# EAGLE design ums (EAGLE 7.6.0)
R.NET interface dongle v.1 OH7JEV & OH3HZB 2013 Based on OH2LAK's CM108 soundcard mod.
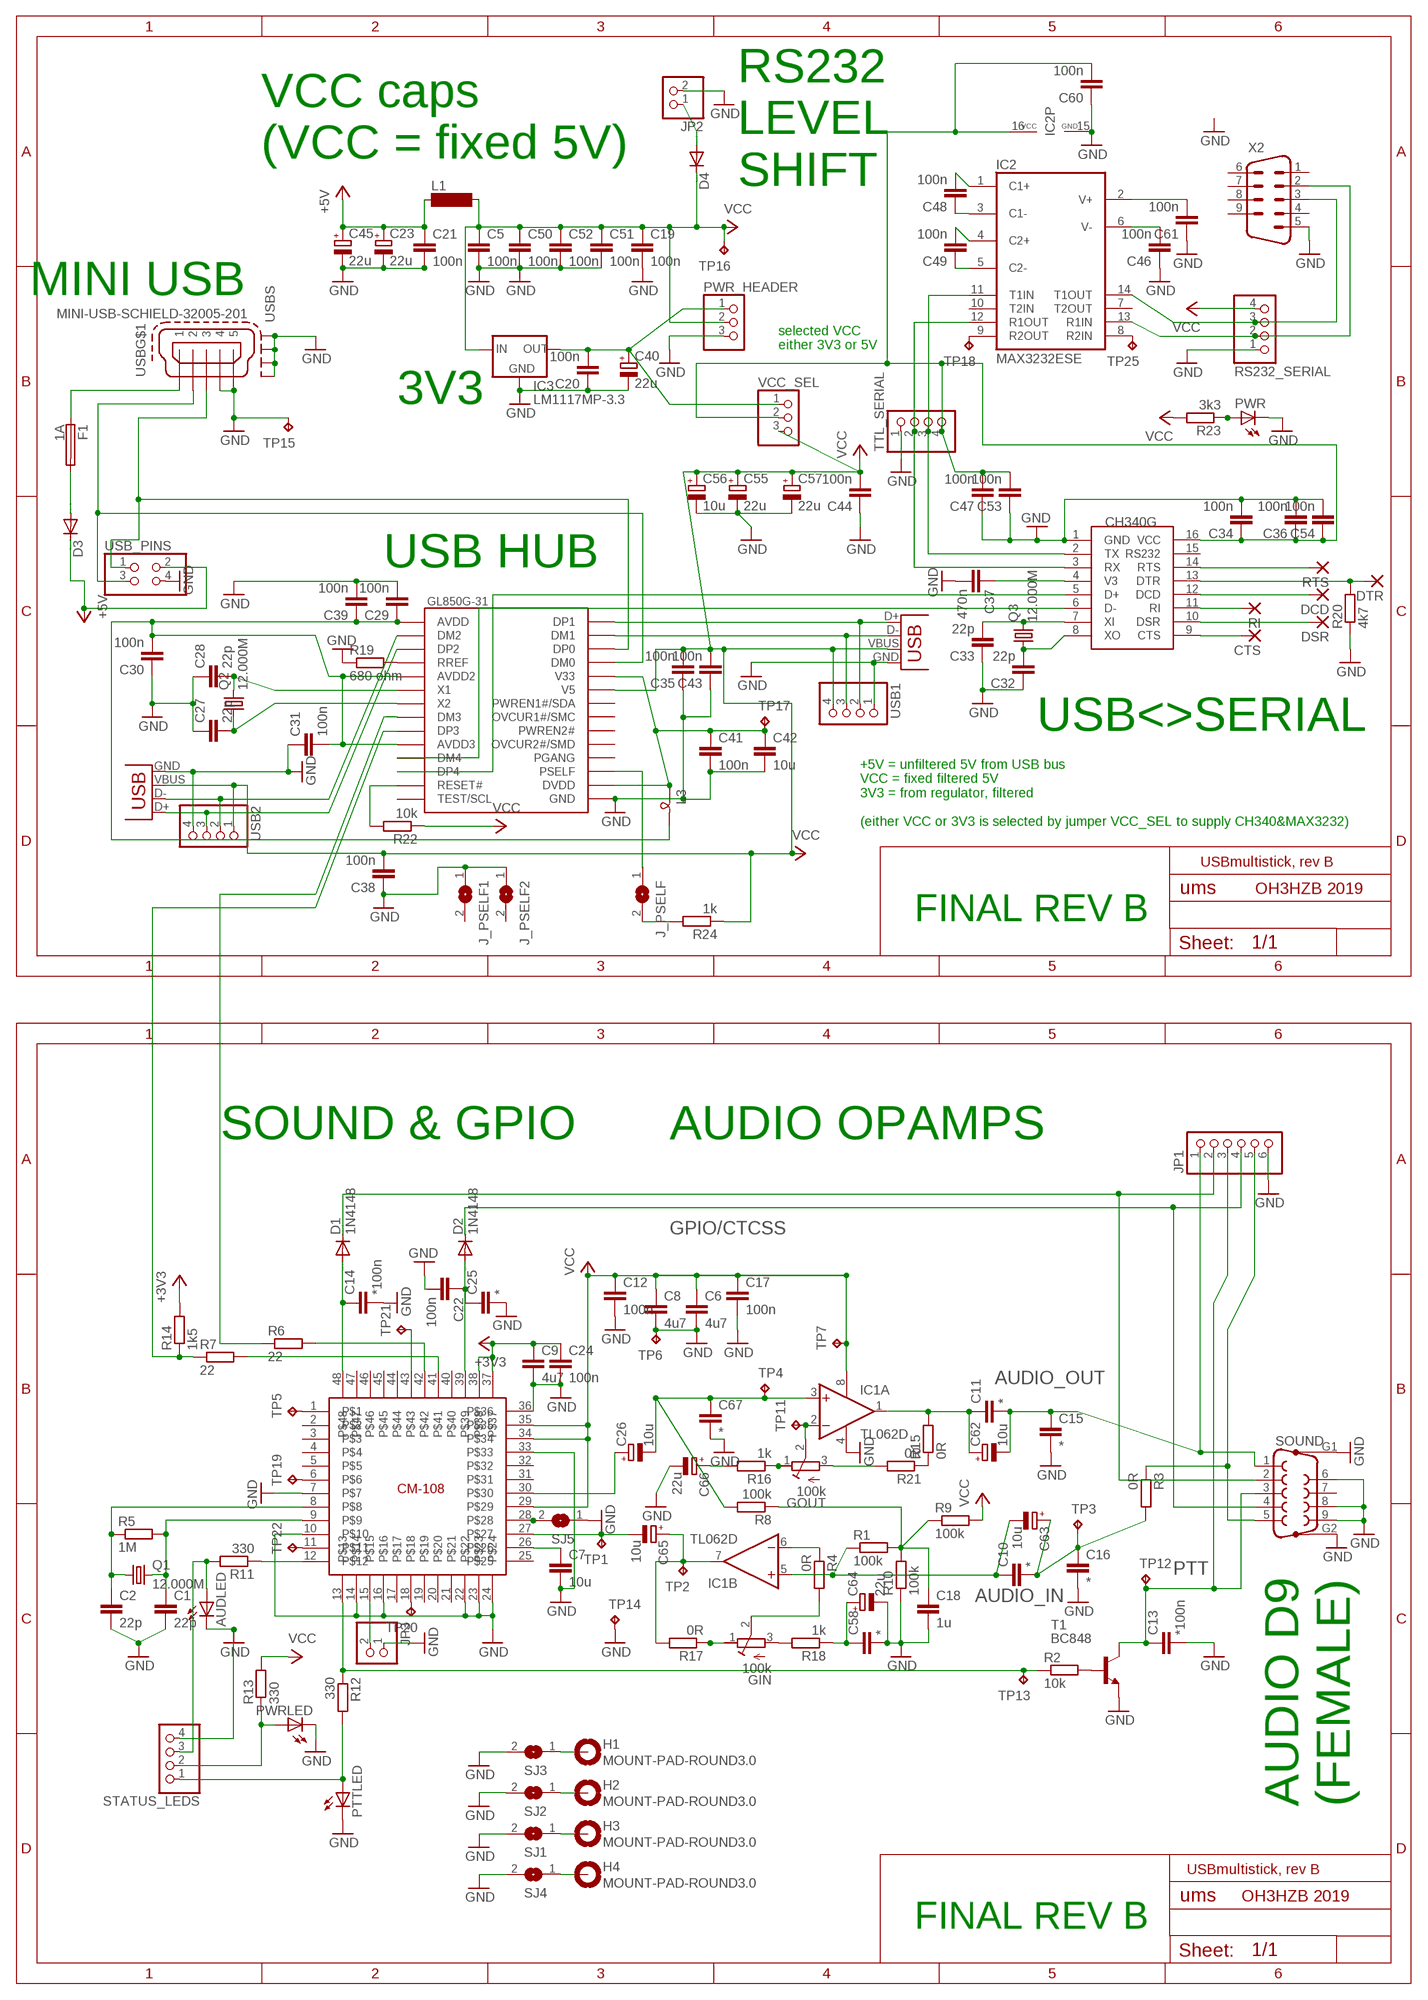
[diagram p0: schematic, sheet 1]

## Parts
AUDLED  LED3MM  [LED3MM]
C1  22p  C-EUC1206K  [C1206K]
C2  22p  C-EUC1206K  [C1206K]
C5  100n  C-EUC1206K  [C1206K]
C6  4u7  C-EUC1206K  [C1206K]
C7  10u  C-EUC1206K  [C1206K]
C8  4u7  C-EUC1206K  [C1206K]
C9  4u7  C-EUC1206K  [C1206K]
C10  *  C-EUC1206K  [C1206K]
C11  *  C-EUC1206K  [C1206K]
C12  100n  C-EUC1206K  [C1206K]
C13  *100n  C-EUC1206K  [C1206K]
C14  *100n  C-EUC1206K  [C1206K]
C15  *  C-EUC0805  [C0805]
C16  *  C-EUC1206K  [C1206K]
C17  100n  C-EUC0805  [C0805]
C18  1u  C-EUC4532  [C4532]
C19  100n  C-EUC0805  [C0805]
C20  100n  C-EUC0805  [C0805]
C21  100n  C-EUC0805  [C0805]
C22  100n  C-EUC0805  [C0805]
C23  22u  CPOL-EUD/7343-31W  [D/7343-31W]
C24  100n  C-EUC0805  [C0805]
C25  *  C-EUC0805  [C0805]
C26  10u  CPOL-EU153CLV-0605  [153CLV-0605]
C27  22p  C-EUC1206K  [C1206K]
C28  22p  C-EUC1206K  [C1206K]
C29  100n  C-EUC0805  [C0805]
C30  100n  C-EUC0805  [C0805]
C31  100n  C-EUC1206  [C1206]
C32  22p  C-EUC1206K  [C1206K]
C33  22p  C-EUC1206K  [C1206K]
C34  100n  C-EUC0805  [C0805]
C35  100n  C-EUC0805  [C0805]
C36  100n  C-EUC0805  [C0805]
C37  470n  C-EUC0805  [C0805]
C38  100n  C-EUC0805  [C0805]
C39  100n  C-EUC0805  [C0805]
C40  22u  CPOL-EUSMCB  [SMC_B]
C41  100n  C-EUC0805  [C0805]
C42  10u  C-EUC0805  [C0805]
C43  100n  C-EUC0805  [C0805]
C44  100n  C-EUC0805  [C0805]
C45  22u  CPOL-EUD/7343-31W  [D/7343-31W]
C46  100n  C-EUC0805  [C0805]
C47  100n  C-EUC0805  [C0805]
C48  100n  C-EUC0805  [C0805]
C49  100n  C-EUC0805  [C0805]
C50  100n  C-EUC0805  [C0805]
C51  100n  C-EUC0805  [C0805]
C52  100n  C-EUC0805  [C0805]
C53  100n  C-EUC0805  [C0805]
C54  100n  C-EUC1206  [C1206]
C55  22u  CPOL-EUC/6032-28R  [C/6032-28R]
C56  10u  CPOL-EUSMCB  [SMC_B]
C57  22u  CPOL-EUCT6032  [CT6032]
C58  *  C-EUC1206K  [C1206K]
C60  100n  C-EUC0805  [C0805]
C61  100n  C-EUC0805  [C0805]
C62  10u  CPOL-EU153CLV-0605  [153CLV-0605]
C63  10u  CPOL-EU153CLV-0605  [153CLV-0605]
C64  22u  CPOL-EU153CLV-0605  [153CLV-0605]
C65  10u  CPOL-EU153CLV-0605  [153CLV-0605]
C66  22u  CPOL-EU153CLV-0605  [153CLV-0605]
C67  *  C-EUC0805  [C0805]
CTS  SMD2  [SMD1,27-2,54]
D1  1N4148  DIODE-SOD123  [SOD123]
D2  1N4148  DIODE-SOD323-W  [SOD323-W]
D3  DIODE-DO214AC  [DO214AC]
D4  DIODE-DO214AC  [DO214AC]
DCD  SMD2  [SMD1,27-2,54]
DSR  SMD2  [SMD1,27-2,54]
DTR  SMD2  [SMD1,27-2,54]
F1  1A  TE5  [TE5]
GIN  100k  R-TRIMMT93YA  [RTRIMT93YA]
GOUT  100k  R-TRIMMT93YA  [RTRIMT93YA]
H1  MOUNT-PAD-ROUND3.0  [3,0-PAD]
H2  MOUNT-PAD-ROUND3.0  [3,0-PAD]
H3  MOUNT-PAD-ROUND3.0  [3,0-PAD]
H4  MOUNT-PAD-ROUND3.0  [3,0-PAD]
IC1  TL062D  [SO08]
IC2  MAX3232ESE  [SO16]
IC3  LM1117MP-3.3  [SOT223]
IC4  GL850G-31  [TSSOP28]
J_PSELF  SJ  [SJ]
J_PSELF1  SJ  [SJ]
J_PSELF2  SJ  [SJ]
JP1  PINHD-1X6  [1X06]
JP2  PINHD-1X2  [1X02]
JP3  PINHD-1X2  [1X02]
L1  SM-1206  [SM-1206]
L3  SM-B5  [SM-B5]
PTTLED  LED3MM  [LED3MM]
PWR  LEDCHIPLED_0805  [CHIPLED_0805]
PWR_HEADER  PINHD-1X3  [1X03]
PWRLED  LED3MM  [LED3MM]
Q1  12.000M  CRYSTALSM49  [SM49]
Q2  12.000M  CRYSTALSM49  [SM49]
Q3  12.000M  CRYSTALSM49  [SM49]
R1  100k  R-EU_R1206  [R1206]
R2  10k  R-EU_R1206  [R1206]
R3  0R  R-EU_R1206  [R1206]
R4  0R  R-EU_R1206  [R1206]
R5  1M  R-EU_R1206  [R1206]
R6  22  R-EU_R1206  [R1206]
R7  22  R-EU_R1206  [R1206]
R8  100k  R-EU_R1206  [R1206]
R9  100k  R-EU_R1206  [R1206]
R10  100k  R-EU_R1206  [R1206]
R11  330  R-EU_R1206  [R1206]
R12  330  R-EU_R1206  [R1206]
R13  330  R-EU_R1206  [R1206]
R14  1k5  R-EU_R1206  [R1206]
R15  0R  R-EU_R1206  [R1206]
R16  1k  R-EU_R1206  [R1206]
R17  0R  R-EU_R1206  [R1206]
R18  1k  R-EU_R1206  [R1206]
R19  680 ohm  R-EU_R0805  [R0805]
R20  4k7  R-EU_R0805  [R0805]
R21  0R  R-EU_R1206  [R1206]
R22  10k  R-EU_R1206  [R1206]
R23  3k3  R-EU_R0805  [R0805]
R24  1k  R-EU_R0805  [R0805]
RI  SMD2  [SMD1,27-2,54]
RS232_SERIAL  PINHD-1X4  [1X04]
RTS  SMD2  [SMD1,27-2,54]
SJ1  SJ  [SJ]
SJ2  SJ  [SJ]
SJ3  SJ  [SJ]
SJ4  SJ  [SJ]
SJ5  SJ  [SJ]
SOUND  F09HP  [F09HP]
STATUS_LEDS  PINHD-1X4  [1X04]
T1  BC848  BC847-NPN-SOT23-BEC  [SOT23-BEC]
TP1  TPB1,27  [B1,27]
TP2  TPB1,27  [B1,27]
TP3  TPB1,27  [B1,27]
TP4  TPB1,27  [B1,27]
TP5  TPB1,27  [B1,27]
TP6  TPB1,27  [B1,27]
TP7  TPB1,27  [B1,27]
TP11  TPB1,27  [B1,27]
TP12  TPB1,27  [B1,27]
TP13  TPB1,27  [B1,27]
TP14  TPB1,27  [B1,27]
TP15  TPB1,27  [B1,27]
TP16  TPB1,27  [B1,27]
TP17  TPB1,27  [B1,27]
TP18  TPB1,27  [B1,27]
TP19  TPB1,27  [B1,27]
TP20  TPB1,27  [B1,27]
TP21  TPB1,27  [B1,27]
TP22  TPB1,27  [B1,27]
TP25  TPB1,27  [B1,27]
TTL_SERIAL  PINHD-1X4  [1X04]
U$1  CM-108  [LQFP-48]
U$6  CH340G  [SOIC16]
USB  MINI-USB-SCHIELD-32005-201  [32005-201]
USB1  PINHD-1X4  [1X04]
USB2  PINHD-1X4  [1X04]
USB-P1  USB-A-H  [USB-A-H]
USB-P2  USB-A-H  [USB-A-H]
USB_PINS  PINHD-2X2  [2X02]
VCC_SEL  PINHD-1X3  [1X03]
X2  M09HP  [M09HP]

## Nets
+3V3: C9.1 C24.1 R14.2 U$1.37 U$1.38
+5V: C21.1 C23.+ C45.+ D3.C L1.1 USB_PINS.2
AUDIO_IN: C10.2 C16.1 C63.+ R3.2 TP3.TP
AUDIO_OUT: C11.2 C15.1 C62.- JP1.1 SOUND.1
CM108-USB-DMINUS: IC4.8(DM3) R6.1
CM108-USB-DPLUS: IC4.9(DP3) R7.1 R14.1
GND: AUDLED.K(C) C1.2 C2.2 C5.2 C6.2 C7.2 C8.2 C9.2 C12.2 C13.2 C14.2 C15.2 C16.2 C17.2 C18.2 C19.2 C20.1 C21.2 C22.2 C23.- C24.2 C25.2 C27.1 C28.1 C29.2 C30.1 C31.1 C32.1 C33.1 C34.2 C35.1 C36.2 C37.2 C38.1 C39.2 C40.- C41.2 C42.2 C43.1 C44.1 C45.- C46.1 C47.1 C50.2 C51.2 C52.2 C53.1 C54.2 C55.- C56.- C57.- C58.2 C60.1 C61.1 C64.- C66.- C67.2 IC1.4(P:V-) IC2.15(GND) IC3.1(GND) IC4.15(GND) J_PSELF1.1 J_PSELF2.1 JP1.6 JP2.2 JP3.1 PTTLED.K(C) PWR.C PWR_HEADER.3 PWRLED.K(C) R10.1 R19.1 R20.1 RS232_SERIAL.1 SJ1.2 SJ2.2 SJ3.2 SJ4.2 SJ5.1 SOUND.6 SOUND.8 SOUND.9 SOUND.G1 SOUND.G2 STATUS_LEDS.4 T1.E TP6.TP TP14.TP TP15.TP TTL_SERIAL.1 U$1.7 U$1.10 U$1.14 U$1.16 U$1.22 U$1.23 U$1.24 U$1.33 U$1.36 U$6.1(GND) USB1.1 USB2.4 USB-P1.GND USB-P2.GND USB.4 USB.5 USB.M1(S:S1) USB.M2(S:S2) USB.M3(S:S3) USB.M4(S:S4) USB_PINS.4 X2.5
GPIO/CTCSS: D2.C JP1.4 SOUND.4
JUMPER_SELECTED_VCC: C34.1 C36.1 C47.2 C53.2 C54.1 C60.2 IC2.16(VCC) TTL_SERIAL.4 U$6.16(VCC) VCC_SEL.2
N$1: IC2.11(T1IN) TTL_SERIAL.3 U$6.2(TX)
N$2: R2.2 T1.B
N$3: C2.1 Q1.1 R5.1 U$1.8
N$4: C1.1 Q1.2 R5.2 U$1.9
N$5: C26.- C67.1 IC1.3(A:+IN) R8.2 TP4.TP
N$6: C65.+ IC1.7(B:OUT) R17.2 TP2.TP
N$7: JP1.5 R3.1 SOUND.5
N$8: C46.2 IC2.6(V-)
N$9: IC4.13(RESET#) R22.2
N$10: C65.- TP1.TP U$1.27
N$11: C26.+ U$1.30
N$12: R2.1 R12.1 TP13.TP U$1.13
N$13: IC4.25(DM0) USB.2 USB_PINS.3
N$14: C22.1 C25.1 D2.A U$1.39
N$15: C11.1 C62.+ IC1.1(A:OUT) R15.2
N$16: R7.2 U$1.41
N$17: R6.2 U$1.42
N$18: C14.1 D1.A U$1.48
N$19: D1.C JP1.2 SOUND.2
N$20: C7.1 U$1.26
N$21: H2.B3,0(MOUNT) SJ2.1
N$22: R11.1 U$1.12
N$23: C18.1 R1.2 R8.1 R9.1 R10.2
N$24: H1.B3,0(MOUNT) SJ3.1
N$25: H4.B3,0(MOUNT) SJ4.1
N$26: C61.2 IC2.2(V+)
N$28: AUDLED.A R11.2 STATUS_LEDS.3
N$29: SJ5.2 U$1.28
N$30: PTTLED.A R12.2 STATUS_LEDS.1
N$31: JP3.2 U$1.15
N$32: IC2.12(R1OUT) TTL_SERIAL.2 U$6.3(RX)
N$33: GOUT.2(S) IC1.2(A:-IN) TP11.TP
N$34: IC1.6(B:-IN) R4.1
N$35: PWR.A R23.1
N$36: C28.2 IC4.6(X1) Q2.2
N$37: C27.2 IC4.7(X2) Q2.1
N$38: D3.A F1.2
N$39: R15.1 R21.1
N$40: GOUT.1(A) R16.1
N$41: GIN.1(A) R17.1
N$42: C29.1 C30.2 C31.2 C39.1 IC4.1(AVDD) IC4.5(AVDD2) IC4.10(AVDD3) L3.2
N$43: GIN.2(S) R4.2
N$44: GIN.3(E) R18.2
N$45: IC4.2(DM2) USB2.2 USB-P1.D-
N$46: C32.2 Q3.1 U$6.8(XO)
N$47: C33.2 Q3.2 U$6.7(XI)
N$48: C37.1 U$6.4(V3)
N$49: IC4.3(DP2) USB2.3 USB-P1.D+
N$50: H3.B3,0(MOUNT) SJ1.1
N$51: IC4.12(DP4) U$6.5(D+)
N$52: IC4.11(DM4) U$6.6(D-)
N$53: CTS.1(P) U$6.9(CTS)
N$54: DSR.1(P) U$6.10(DSR)
N$55: RI.1(P) U$6.11(RI)
N$56: DCD.1(P) U$6.12(DCD)
N$57: DTR.1(P) R20.2 U$6.13(DTR)
N$58: RTS.1(P) U$6.14(RTS)
N$59: IC4.28(DP1) USB1.2 USB-P2.D+
N$60: IC4.27(DM1) USB1.3 USB-P2.D-
N$61: IC2.9(R2OUT) TP18.TP
N$62: C20.2 C40.+ IC3.2(OUT) IC3.4(OUT) PWR_HEADER.1 VCC_SEL.1
N$63: IC4.26(DP0) USB.3 USB_PINS.1
N$64: TP19.TP U$1.6
N$65: IC4.17(PSELF) J_PSELF.1
N$66: C41.1 C42.1 IC4.16(DVDD) IC4.24(V33) L3.1 TP17.TP
N$67: TP20.TP U$1.18
N$68: IC4.4(RREF) R19.2
N$69: IC2.13(R1IN) RS232_SERIAL.2 X2.2
N$70: IC2.14(T1OUT) RS232_SERIAL.3 X2.3
N$71: D4.A JP2.1
N$72: C49.1 IC2.5(C2-)
N$73: C49.2 IC2.4(C2+)
N$74: C48.1 IC2.3(C1-)
N$75: C48.2 IC2.1(C1+)
N$76: TP21.TP U$1.43
N$77: TP22.TP U$1.11
N$78: PWRLED.A R13.1 STATUS_LEDS.2
N$79: J_PSELF.2 R24.2
N$80: IC2.8(R2IN) TP25.TP
N$81: F1.1 USB.1
N$82: C10.1 C63.- IC1.5(B:+IN) R1.1
N$83: C58.1 C64.+ R18.1
N$84: C66.+ R16.2
N$85: TP5.TP U$1.1
N$86: GOUT.3(E) R21.2
PTT: C13.1 JP1.3 SOUND.3 T1.C TP12.TP
VCC: C5.1 C6.1 C8.1 C12.1 C17.1 C19.1 C35.2 C38.2 C43.2 C44.2 C50.1 C51.1 C52.1 C55.+ C56.+ C57.+ D4.C IC1.8(P:V+) IC3.3(IN) IC4.23(V5) L1.2 PWR_HEADER.2 R9.2 R13.2 R22.1 R23.2 R24.1 RS232_SERIAL.4 TP7.TP TP16.TP U$1.29 U$1.34 U$1.35 USB1.4 USB2.1 USB-P1.VBUS USB-P2.VBUS VCC_SEL.3
Unconnected: IC2.7(T2OUT) IC2.10(T2IN) IC4.14(TEST/SCL) IC4.18(PGANG) IC4.19(OVCUR2#/SMD) IC4.20(PWREN2#) IC4.21(OVCUR1#/SMC) IC4.22(PWREN1#/SDA) J_PSELF1.2 J_PSELF2.2 SOUND.7 U$1.2 U$1.3 U$1.4 U$1.5 U$1.17 U$1.19 U$1.20 U$1.21 U$1.25 U$1.31 U$1.32 U$1.40 U$1.44 U$1.45 U$1.46 U$1.47 U$6.15(RS232) X2.1 X2.4 X2.6 X2.7 X2.8 X2.9

## Notes on the sheet
- VCC caps
  (VCC = fixed 5V)
- RS232 
  LEVEL 
  SHIFT
- MINI USB
- selected VCC
  either 3V3 or 5V
- 3V3
- USB HUB
- USB<>SERIAL
- +5V = unfiltered 5V from USB bus
  VCC = fixed filtered 5V
  3V3 = from regulator, filtered 
  
  (either VCC or 3V3 is selected by jumper VCC_SEL to supply CH340&MAX3232)
- USBmultistick, rev B
- OH3HZB 2019
- FINAL REV B
- SOUND & GPIO | AUDIO OPAMPS
- AUDIO D9
  (FEMALE)
- USBmultistick, rev B
- OH3HZB 2019
- FINAL REV B

## Library data of the parts
AUDLED PTTLED PWR PWRLED = led:LED: LED OSRAM: - CHIPLED LG R971, LG N971, LY N971, LG Q971, LY Q971, LO R971, LY R971 LH N974, LH R974 LS Q976, LO Q976, LY Q976 LO Q996 - Hyper CHIPLED LW Q18S LB Q993, LB Q99A, LB R99A - SideLED LS A670, LO A670, LY A670, LG A670, LP A670 LB A673, LV A673, LT A673, LW A673 LH A674 LY A675 LS A676, LA A676, LO A676, LY A676, LW A676 LS A679, LY A679, LG A679 - Hyper Micro SIDELED® LS Y876, LA Y876, LO Y876, LY Y876 LT Y87S - SmartLED LW L88C, LW L88S LB L89C, LB L89S, LG L890 LS L89K, LO L89K, LY L89K LS L896, LA L896, LO L896, LY L896 - TOPLED LS T670, LO T670, LY T670, LG T670, LP T670 LSG T670, LSP T670, LSY T670, LOP T670, LYG T670 LG T671, LOG T671, LSG T671 LB T673, LV T673, LT T673, LW T673 LH T674 LS T676, LA T676, LO T676, LY T676, LB T676, LH T676, LSB T676, LW T676 LB T67C, LV T67C, LT T67C, LS T67K, LO T67K, LY T67K, LW E67C LS E67B, LA E67B, LO E67B, LY E67B, LB E67C, LV E67C, LT E67C LW T67C LS T679, LY T679, LG T679 LS T770, LO T770, LY T770, LG T770, LP T770 LB T773, LV T773, LT T773, LW T773 LH T774 LS E675, LA E675, LY E675, LS T675 LS T776, LA T776, LO T776, LY T776, LB T776 LHGB T686 LT T68C, LB T68C - Hyper Mini TOPLED® LB M676 - Mini TOPLED Santana® LG M470 LS M47K, LO M47K, LY M47K Source: http://www.osram.convergy.de LUXEON: - LUMILED® LXK2-PW12-R00, LXK2-PW12-S00, LXK2-PW14-U00, LXK2-PW14-V00 LXK2-PM12-R00, LXK2-PM12-S00, LXK2-PM14-U00 LXK2-PE12-Q00, LXK2-PE12-R00, LXK2-PE12-S00, LXK2-PE14-T00, LXK2-PE14-U00 LXK2-PB12-K00, LXK2-PB12-L00, LXK2-PB12-M00, LXK2-PB14-N00, LXK2-PB14-P00, LXK2-PB14-Q00 LXK2-PR12-L00, LXK2-PR12-M00, LXK2-PR14-Q00, LXK2-PR14-R00 LXK2-PD12-Q00, LXK2-PD12-R00, LXK2-PD12-S00 LXK2-PH12-R00, LXK2-PH12-S00 LXK2-PL12-P00, LXK2-PL12-Q00, LXK2-PL12-R00 Source: www.luxeon.com KINGBRIGHT: KA-3528ASYC Source: www.kingbright.com
C1 C2 C5-C22 C24 C25 C27-C39 C41-C44 C46-C54 C58 C60 C61 C67 = resistor:C-EU: CAPACITOR, European symbol
C23 C26 C40 C45 C55-C57 C62-C66 = rcl:CPOL-EU: POLARIZED CAPACITOR, European symbol
CTS DCD DSR DTR RI RTS = wirepad:SMD2: SMD PAD
D1-D4 = diode:DIODE-: DIODE
F1 = fuse:TE5: FUSE Wickmann; OC_FARNELL: unknown; OC_NEWARK: unknown
GIN GOUT = rcl:R-TRIMM: Trimm resistor
H1-H4 = holes:MOUNT-PAD-ROUND: MOUNTING PAD, round
IC1 = linear:TL062: OP AMP
IC2 = maxim:MAX3232*: True RS-232 Transceivers 3.0V to 5.5V, Low-Power up to 1Mbps, Using Four 0.1µF External Capacitors Source: http://pdfserv.maxim-ic.com/en/ds/MAX3222-MAX3241.pdf; MF: MAXIM; MPN: MAX3232ESE; OC_FARNELL: 9725539; OC_NEWARK: 79C3880
IC3 = lm1117_10:LM1117?-*: 800mA Low-Dropout Linear Regulator Source: http://www.ti.com/lit/ds/symlink/lm1117-n.pdf; MF: Texas Instruments; MPN: LM1117MP-3.3; OC_FARNELL: 9778195; OC_NEWARK: 28X3416
IC4 = pimoroni:GL850G-31
J_PSELF J_PSELF1 J_PSELF2 SJ1-SJ5 = jumper:SJ: SMD solder JUMPER
JP1 = pinhead:PINHD-1X6: PIN HEADER
JP2 JP3 = pinhead:PINHD-1X2: PIN HEADER
L1 = inductor-neosid:SM-1206: INDUCTOR SMD chip inductor; OC_FARNELL: unknown; OC_NEWARK: unknown
L3 = inductor-neosid:SM-B: INDUCTOR SMD Bead inductor; OC_FARNELL: unknown; OC_NEWARK: unknown
PWR_HEADER VCC_SEL = pinhead:PINHD-1X3: PIN HEADER
Q1-Q3 = crystal:CRYSTAL: CRYSTAL; OC_FARNELL: unknown; OC_NEWARK: unknown
R1-R18 R20 R21 R23 R24 = resistor:R-EU_: RESISTOR, European symbol
R19 R22 = rcl:R-EU_: RESISTOR, European symbol
RS232_SERIAL STATUS_LEDS TTL_SERIAL USB1 USB2 = pinhead:PINHD-1X4: PIN HEADER
SOUND = subd-modified:F09HP: SUB-D; OC_FARNELL: unknown; OC_NEWARK: unknown
T1 = transistor:*-NPN-: NPN Transistror BF959 corrected 2008.03.06
TP1-TP7 TP11-TP22 TP25 = testpad:TP: Test pad
U$1 = cm-108:CM-108
U$6 = ch340g:CH340G
USB = con-cypressindustries:MINI-USB-SCHIELD-: MINI USB-B Conector Source: www.cypressindustries.com; OC_FARNELL: unknown; OC_NEWARK: unknown
USB-P1 USB-P2 = con-usb:USB: USB Connectors
USB_PINS = pinhead:PINHD-2X2: PIN HEADER
X2 = con-subd:M09: SUB-D; OC_FARNELL: unknown; OC_NEWARK: unknown

## Board
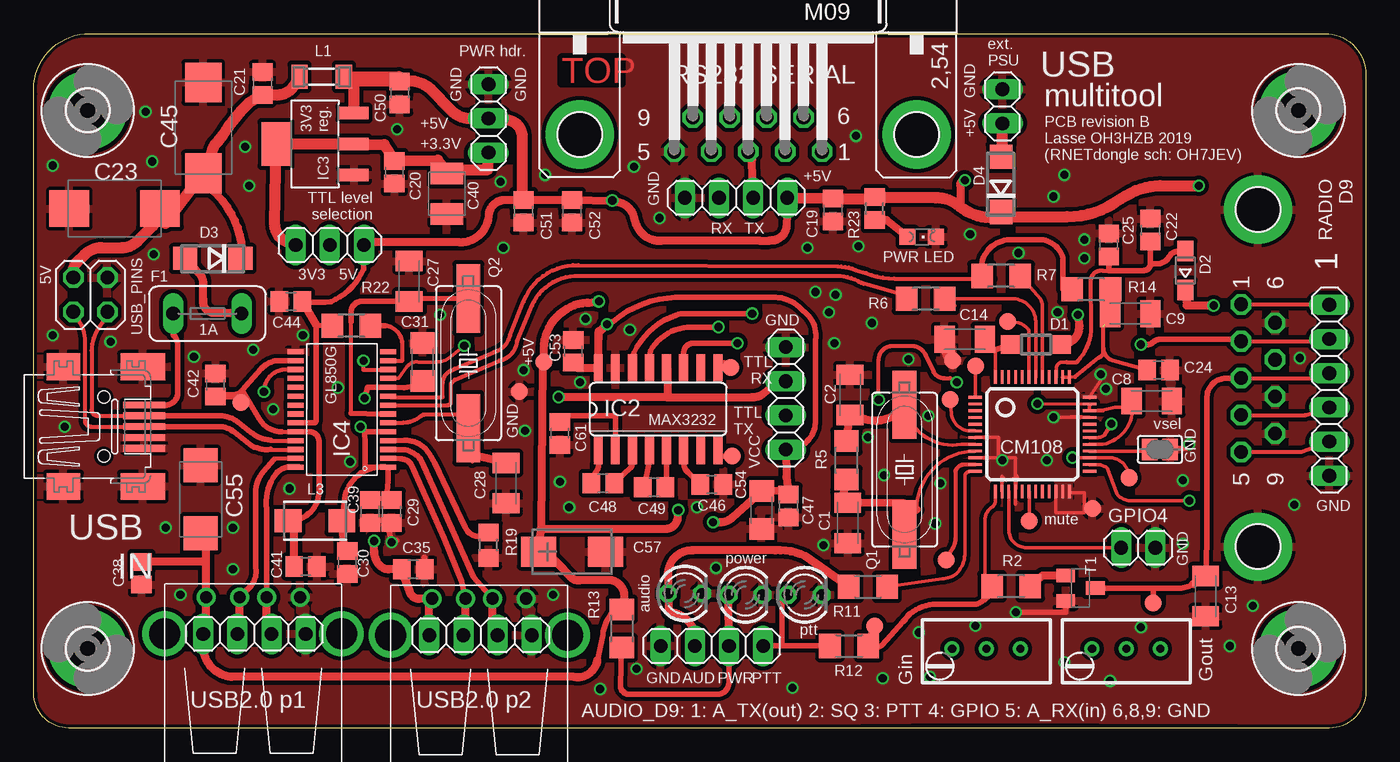
[diagram p1: board, top side]
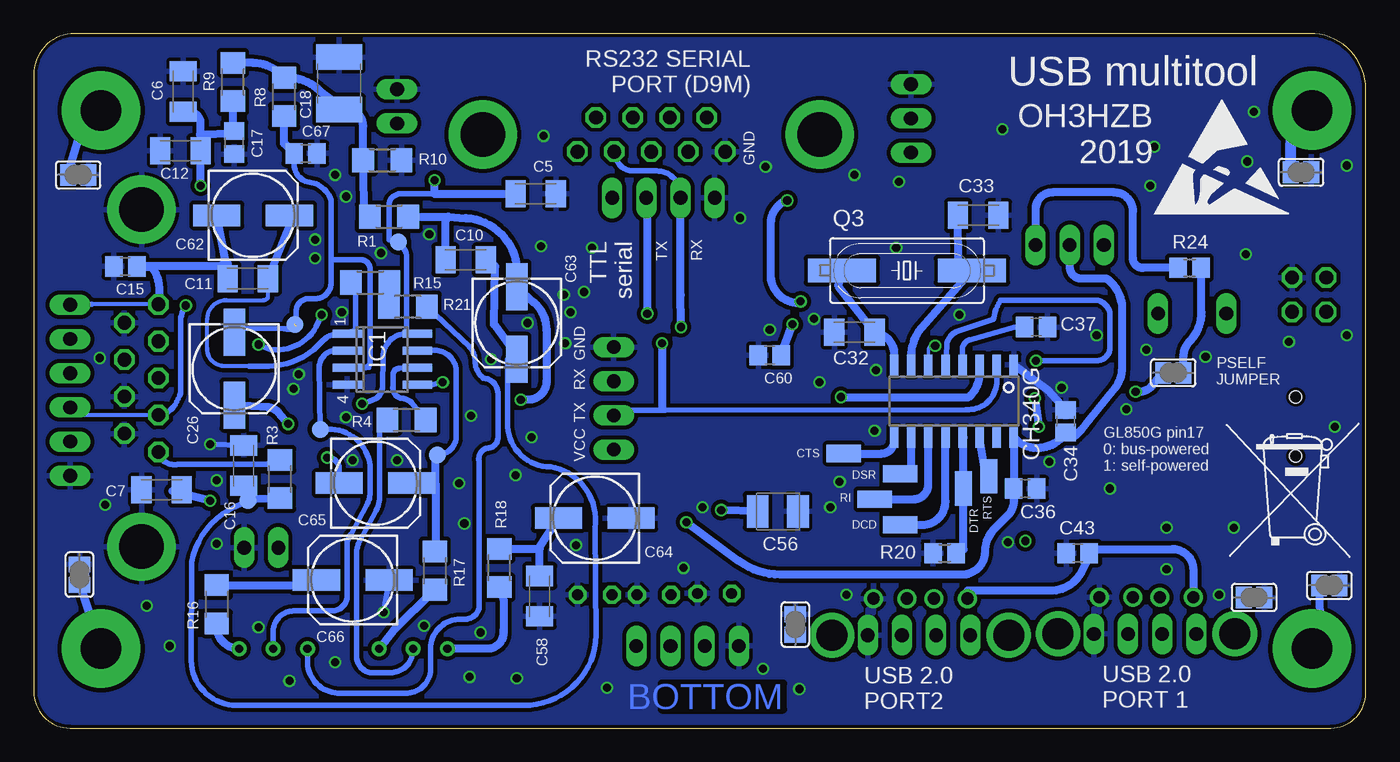
[diagram p2: board, bottom side, seen from below]

Size 99.03 x 51.6 mm. Coordinates in mm from the lower left corner, seen from the top.
Outline: 0.01,2.59 0.01,47.11 arc-90 3.8,51.6 96.26,51.6 arc-90 99.01,48.24 99.01,2.69 arc-90 96.32,0 2.6,0 arc-90 0.01,2.59
Copper layers (1*16): Top 0.035mm / dielectric 1.5mm / Bottom 0.035mm
Design rules "Fusion_eagle_rule_v1.1 *": minimum track width 6mil, minimum drill 12mil, track to track 12mil, track to pad 12mil, pad to pad 12mil, via to via 12mil, smd to smd 0mil, copper to edge 10mil, drill to drill 10mil, minimum pad ring 10mil, minimum via ring 6mil, stop-mask expansion 2mil, vias tented up to drill 100mil, thermal gap 10mil

### Footprints (pad centres in the part's own frame; a part is rotated, then mirrored left to right if it is on the bottom)
LED3MM = drill 0.813 octagon: A -1.27,0; K 1.27,0
C1206K = smd 1.5 x 2: 1 -1.5,0; 2 1.5,0
C0805 = smd 1.3 x 1.5: 1 -0.85,0; 2 0.85,0
C4532 = smd 1.9 x 3.4: 1 -1.95,0; 2 1.95,0
D/7343-31W = smd 2.95 x 2.7: + 3.375,0; - -3.375,0
153CLV-0605 = smd 3.5 x 1.6: + 2.7,0; - -2.7,0
C1206 = smd 1.6 x 1.8: 1 -1.4,0; 2 1.4,0
SMC_B = smd 1.6 x 2.4: + -1.5,0; - 1.5,0
C/6032-28R = smd 2.55 x 2.5: + 2.525,0; - -2.525,0
CT6032 = smd 2.6 x 2.2: + -2.5,0; - 2.5,0
SMD1,27-2,54 = smd 1.27 x 2.54: 1 0,0
SOD123 = smd 1.4 x 1.4: A 1.9,0; C -1.9,0
SOD323-W = smd 1.5 x 1.2: A 1.45,0; C -1.45,0
DO214AC = smd 1.8 x 1.7: A 2.05,0; C -2.05,0
TE5 = drill 1.016 long: 1 -2.54,0; 2 2.54,0
RTRIMT93YA = drill 0.61: 1 0,-2.54; 2 0,0; 3 0,2.54
3,0-PAD = drill 3 pad 5.842: B3,0 0,0
SO08 = smd 0.6 x 2.2: 1 -1.905,-2.6; 2 -0.635,-2.6; 3 0.635,-2.6; 4 1.905,-2.6; 5 1.905,2.6; 6 0.635,2.6; 7 -0.635,2.6; 8 -1.905,2.6
SO16 = smd 0.66 x 2.032: 1 -4.445,-3.073; 2 -3.175,-3.073; 3 -1.905,-3.073; 4 -0.635,-3.073; 5 0.635,-3.073; 6 1.905,-3.073; 7 3.175,-3.073; 8 4.445,-3.073; 9 4.445,3.073; 10 3.175,3.073; 11 1.905,3.073; 12 0.635,3.073; 13 -0.635,3.073; 14 -1.905,3.073; 15 -3.175,3.073; 16 -4.445,3.073
SOT223 = smd 0.95 x 2.15: 1 -2.3,-2.9; 2 0,-2.9; 3 2.3,-2.9 | smd 3.25 x 2.15: 4 0,2.9
TSSOP28 = smd 1.2 x 0.38: 1 -3.429,4.623; 2 -3.429,3.962; 3 -3.429,3.302; 4 -3.429,2.642; 5 -3.429,1.981; 6 -3.429,1.321; 7 -3.429,0.66; 8 -3.435,0; 9 -3.429,-0.66; 10 -3.429,-1.321; 11 -3.429,-1.981; 12 -3.429,-2.642; 13 -3.429,-3.302; 14 -3.429,-3.962; 15 3.429,-3.962; 16 3.429,-3.302; 17 3.429,-2.642; 18 3.429,-1.981; 19 3.429,-1.321; 20 3.429,-0.66; 21 3.435,0; 22 3.429,0.66; 23 3.429,1.321; 24 3.429,1.981; 25 3.429,2.642; 26 3.429,3.302; 27 3.429,3.962; 28 3.429,4.623
SJ = smd 1.168 x 1.6: 1 -0.762,0; 2 0.762,0
1X06 = drill 1.016 long: 1 -6.35,0; 2 -3.81,0; 3 -1.27,0; 4 1.27,0; 5 3.81,0; 6 6.35,0
1X02 = drill 1.016 long: 1 -1.27,0; 2 1.27,0
SM-1206 = smd 1.2 x 1.8: 1 -1.65,0; 2 1.65,0
SM-B5 = smd 2 x 1.7: 1 -2,0; 2 2,0
CHIPLED_0805 = smd 1.2 x 1.2: A 0,-1.05; C 0,1.05
1X03 = drill 1.016 long: 1 -2.54,0; 2 0,0; 3 2.54,0
SM49 = smd 5.08 x 1.778: 1 -4.826,0; 2 4.826,0
R1206 = smd 1.6 x 1.803: 1 -1.422,0; 2 1.422,0
R0805 = smd 1.3 x 1.5: 1 -0.95,0; 2 0.95,0
R0805' = smd 1.3 x 1.5: 1 -0.85,0; 2 0.85,0
1X04 = drill 1.016 long: 1 -3.81,0; 2 -1.27,0; 3 1.27,0; 4 3.81,0
F09HP = drill 1.016 octagon: 1 -5.486,-1.27; 2 -2.743,-1.27; 3 0,-1.27; 4 2.743,-1.27; 5 5.486,-1.27; 6 -4.115,1.27; 7 -1.372,1.27; 8 1.372,1.27; 9 4.115,1.27 | drill 3.302 pad 5.08: G1 -12.522,0; G2 12.522,0
SOT23-BEC = smd 1 x 1.4: B -0.95,-1.1; C 0,1.1; E 0.95,-1.1
B1,27 = smd 1.27 x 1.27: TP 0,0
LQFP-48 = smd 0.2 x 1: 1 -2.75,-4.25; 2 -2.25,-4.25; 3 -1.75,-4.25; 4 -1.25,-4.25; 5 -0.75,-4.25; 6 -0.25,-4.25; 7 0.25,-4.25; 8 0.75,-4.25; 9 1.25,-4.25; 10 1.75,-4.25; 11 2.25,-4.25; 12 2.75,-4.25; 25 2.75,4.25; 26 2.25,4.25; 27 1.75,4.25; 28 1.25,4.25; 29 0.75,4.25; 30 0.25,4.25; 31 -0.25,4.25; 32 -0.75,4.25; 33 -1.25,4.25; 34 -1.75,4.25; 35 -2.25,4.25; 36 -2.75,4.25 | smd 1 x 0.2: 13 4.25,-2.75; 14 4.25,-2.25; 15 4.25,-1.75; 16 4.25,-1.25; 17 4.25,-0.75; 18 4.25,-0.25; 19 4.25,0.25; 20 4.25,0.75; 21 4.25,1.25; 22 4.25,1.75; 23 4.25,2.25; 24 4.25,2.75; 37 -4.25,2.75; 38 -4.25,2.25; 39 -4.25,1.75; 40 -4.25,1.25; 41 -4.25,0.75; 42 -4.25,0.25; 43 -4.25,-0.25; 44 -4.25,-0.75; 45 -4.25,-1.25; 46 -4.25,-1.75; 47 -4.25,-2.25; 48 -4.25,-2.75
SOIC16 = smd 0.635 x 1.524: 1 -4.445,-2.695; 2 -3.175,-2.695; 3 -1.905,-2.695; 4 -0.635,-2.695; 5 0.635,-2.695; 6 1.905,-2.695; 7 3.175,-2.695; 8 4.445,-2.695; 9 4.445,2.695; 10 3.175,2.695; 11 1.905,2.695; 12 0.635,2.695; 13 -0.635,2.695; 14 -1.905,2.695; 15 -3.175,2.695; 16 -4.445,2.695
32005-201 = smd 3.1 x 0.5: 1 3,1.6; 2 3,0.8; 3 3,0; 4 3,-0.8; 5 3,-1.6 | smd 2.5 x 2: M1 -3,-4.45; M2 -3,4.45 | smd 3.3 x 2: M3 2.9,4.45; M4 2.9,-4.45 | hole 0.9: 0,2.2; 0,-2.2
USB-A-H = drill 0.914: D+ 2.718,-1.003; D- 2.718,1.003; GND 2.718,-3.493; VBUS 2.718,3.493 | drill 2.311: P$5 0,-6.566; P$6 0,6.566
2X02 = drill 1.016 octagon: 1 -1.27,-1.27; 2 -1.27,1.27; 3 1.27,-1.27; 4 1.27,1.27
M09HP = drill 1.016 octagon: 1 -5.486,1.27; 2 -2.743,1.27; 3 0,1.27; 4 2.743,1.27; 5 5.486,1.27; 6 -4.115,-1.27; 7 -1.372,-1.27; 8 1.372,-1.27; 9 4.115,-1.27 | drill 3.302 pad 5.08: G1 -12.522,0; G2 12.522,0

### Placement (x,y rotation side)
AUDLED  48.41,10 0 top
C1  60.51,15.24 270 top
C2  60.69,24.76 90 top
C5  61.71,39.7 0 bottom
C6  87.91,47.3 90 bottom
C7  89.51,17.7 180 bottom
C8  83.11,24.3 0 top
C9  81.51,30.8 0 top
C10  66.91,34.8 0 bottom
C11  83.11,33.4 180 bottom
C12  88.11,42.9 180 bottom
C13  87.11,9.8 270 top
C14  69.21,28.9 180 top
C15  92.21,34.3 180 bottom
C16  83.41,19.5 90 bottom
C17  84.11,43.5 270 bottom
C18  76.31,47.9 90 bottom
C19  59.41,38.5 270 top
C20  26.81,41.3 90 top
C21  17.01,47.9 90 top
C22  83.01,37 90 top
C23  6.01,38.6 0 top
C24  83.61,26.6 0 top
C25  79.91,35.9 90 top
C26  84.11,26.7 270 bottom
C27  27.91,33.2 270 top
C28  35.11,18.2 90 top
C29  26.61,16.1 270 top
C30  23.31,12.3 90 top
C31  28.91,27.2 270 top
C32  38.01,29.4 0 bottom
C33  28.81,38.1 180 bottom
C34  22.31,22.8 90 bottom
C35  28.21,11.8 180 top
C36  25.31,17.8 0 bottom
C37  24.51,29.8 0 bottom
C38  8.01,11.5 90 top
C39  25.01,16.1 270 top
C40  30.71,39.7 270 top
C41  20.21,12 0 top
C42  13.51,25.5 90 top
C43  21.41,13 0 bottom
C44  19.11,31.7 0 top
C45  12.61,44.6 270 top
C46  50.41,18.1 180 top
C47  56.11,16.5 90 top
C48  42.31,18.2 180 top
C49  46.11,17.9 180 top
C50  27.21,47.2 270 top
C51  36.41,38.4 270 top
C52  40.01,38.4 270 top
C53  40.11,28 270 top
C54  54.11,16.2 270 top
C55  12.41,17 270 top
C56  43.71,16.1 0 bottom
C57  40.01,13.1 0 top
C58  61.41,9.8 270 bottom
C60  44.31,27.7 0 bottom
C61  39.11,21.9 90 top
C62  82.71,38.1 0 bottom
C63  63.11,30.1 270 bottom
C64  57.31,15.6 180 bottom
C65  73.61,18.2 0 bottom
C66  75.31,11 180 bottom
C67  78.81,42.7 0 bottom
CTS  38.81,20.4 270 bottom
D1  74.51,28.5 180 top
D2  85.61,34 90 top
D3  13.31,34.9 180 top
D4  71.91,40.4 90 top
DCD  34.61,15.1 270 bottom
DSR  34.61,18.9 270 bottom
DTR  29.91,17.8 0 bottom
F1  12.91,30.8 0 top
GIN  70.81,5.9 90 top
GOUT  81.21,5.9 90 top
H1  94.01,45.9 0 top
H2  4.01,45.9 0 top
H3  4.01,5.9 270 top
H4  94.01,5.9 0 top
IC1  73.11,27.4 270 bottom
IC2  46.41,23.7 0 top
IC3  20.91,43.4 90 top
IC4  22.91,24 180 top
J_PSELF  14.31,26.4 0 bottom
J_PSELF1  42.41,7.7 270 bottom
J_PSELF2  8.31,9.7 180 bottom
JP1  96.31,25.1 270 top
JP2  72.01,46.2 90 top
JP3  82.11,13.4 180 top
L1  21.41,48.4 0 top
L3  20.91,15.4 0 top
PTTLED  57.31,9.9 0 top
PWR  66.01,36.5 270 top
PWR_HEADER  33.81,45.3 90 top
PWRLED  52.91,9.9 0 top
Q1  64.73,19.2 270 top
Q2  32.31,27.1 270 top
Q3  34.11,34 0 bottom
R1  72.61,38 180 bottom
R2  72.66,10.54 0 top
R3  80.71,18.5 270 bottom
R4  71.31,22.9 180 bottom
R5  60.41,19.9 270 top
R6  66.31,31.9 0 top
R7  71.91,33.6 0 top
R8  80.41,46.9 270 bottom
R9  84.21,48 270 bottom
R10  73.11,42.2 180 bottom
R11  62.01,10.5 180 top
R12  60.61,6.1 180 top
R13  43.71,7.4 90 top
R14  78.61,32.6 0 top
R15  74.01,33.1 180 bottom
R16  85.41,9.2 90 bottom
R17  69.21,11.7 90 bottom
R18  64.41,11.9 270 bottom
R19  33.81,13.6 90 top
R20  4k7  [R0805']  31.31,13 0 bottom
R21  71.21,31.3 0 bottom
R22  23.61,29.9 0 top
R23  3k3  [R0805']  62.51,38.6 90 top
R24  1k  [R0805']  13.11,34.2 0 bottom
RI  36.51,17 270 bottom
RS232_SERIAL  52.21,39.4 0 top
RTS  28.01,18.7 0 bottom
SJ1  2.71,10.6 0 bottom
SJ2  4.81,41.3 0 bottom
SJ3  95.71,41.1 0 bottom
SJ4  95.61,11.4 90 bottom
SJ5  83.71,20.7 180 top
SOUND  91.01,26 270 top
STATUS_LEDS  50.41,6.1 180 top
T1  77.81,10.4 270 top
TP1  81.41,18.6 90 top
TP2  69.01,20.3 0 bottom
TP3  83.11,16.9 0 bottom
TP4  79.61,30 0 bottom
TP5  70.01,26.9 0 top
TP6  68.31,27.3 0 top
TP7  71.91,36.1 0 bottom
TP11  77.71,22.2 0 bottom
TP12  83.21,9.3 0 top
TP13  62.51,7.6 0 top
TP14  78.71,16.3 0 top
TP15  36.11,25 0 top
TP16  37.91,27.2 270 top
TP17  15.41,24.2 0 top
TP18  51.81,26.8 0 top
TP19  68.11,24.4 0 top
TP20  74.01,15.4 0 top
TP21  72.41,30.2 0 top
TP22  67.81,12.5 0 top
TP25  51.91,20.2 0 top
TTL_SERIAL  55.91,24.5 270 top
U$1  74.23,21.83 270 top
U$2  [ESD_10.00]  15.81,38.1 0 bottom
U$3  [MUELLTONNE_10.00]  11.01,12.3 0 bottom
U$6  30.61,24.3 180 bottom
USB  5.21,22.4 0 top
USB1  16.41,7 180 top
USB2  33.21,6.9 0 top
USB-P1  33.11,6.9 90 top
USB-P2  16.31,7 90 top
USB_PINS  4.21,32.2 0 top
VCC_SEL  22.01,35.9 0 top
X2  53.11,44.1 180 top

### Tracks (layer width: path | path; a pad name or v marks a point on that pad's centre or on a via)
+3V3
  Top 0.254: 77.4,26.1 U$1.37 U$1.38 | 79.51,30.2 79.53,30.5 C9.1
  Top 0.305: 77.4,26.1 79.19,27.55 arc56 79.51,27.87 79.51,30.2 | C24.1 80.21,27.31 arc-74 79.53,28.21 79.53,30.5
  Top 0.813: R14.2 79.81,32.6 C9.1
+5V
  Top 0.61: 8.86,37.33 C23.+ | D3.C 15.51,35.53 arc45 13.27,39.97 C45.+
  Top 0.813: C23.+ 9.79,37.5 C45.+ 13.2,42.12 13.2,42.45 arc-45 13.66,43.57 14.07,44.08 arc-13 16.01,46.46 C21.1 17.9,47.05 arc63 19.37,47.73 L1.1 | USB_PINS.2 2.94,33.94 arc-45 3.22,34.6 3.8,35.18 arc-45 5.05,35.7 6.57,35.7 arc45 7.71,36.17 8.86,37.33
AUDIO_IN
  Bottom 0.406: R3.2 81.97,17 arc-74 87.3,12.3 87.31,5 arc-90 83.92,1.7 62.61,1.7 arc-90 57.21,6.9 57.31,14.9 arc-90 60.61,19.4 arc90 63.81,22.7 63.81,27.4 C63.+ 63.07,27.14
  Bottom 0.61: R3.2 82.59,17 TP3.TP 83.01,16.9 C16.1 | C63.+ 63.11,27.7 64.81,30 64.71,34.3 65.21,34.8 C10.2
AUDIO_OUT
  Top 0.305: SOUND.1 96.01,31.49 JP1.1
  Bottom 0.305: SOUND.1 94.71,31.49
  Bottom 0.406: 94.71,31.49 JP1.1
  Bottom 0.61: 84.71,34.5 C62.- | SOUND.1 89.74,31.87 arc-45 90.22,34.25 C15.1 85.01,34.3
  Bottom 0.813: C11.2 84.71,34.5 85.01,34.3
CM108-USB-DMINUS
  Top 0.305: R6.1 64.21,32.3 61.71,33 61.52,33.08 arc35 59.68,33.6 40.56,33.6 arc70 37.06,31.4 35.94,28.74 arc-72 34.63,27.3 31.32,25.9 31.11,25.69 arc45 31.01,25.56 31.01,24.22 arc-90 30.79,24 IC4.8
CM108-USB-DPLUS
  Top 0.305: R14.1 77.21,32.6 | R7.1 71.19,33.4 63.98,33.4 arc-22 61.9,33.81 61.11,34.04 arc22 59.76,34.3 40.47,34.4 arc70 36.43,31.71 35.41,29.2 35.42,29.16 arc-62 34.21,27.94 31.32,26.7 31.02,26.57 arc66 30.41,25.64 30.41,24.6 26.58,24.6 IC4.9
  Top 0.406: R7.1 70.41,33.82 70.41,33.96 arc-90 72.57,36.3 74.88,36.3 arc-72 76.51,34.91 76.51,32.6 R14.1
GND  (via drill 0.6)
  Top 0.254: U$1.10 71.71,20.08 | 71.71,20.08 72.98,20.08 U$1.16 72.98,16.63 73.01,18.8 73.11,18.6 72.31,18.4 71.98,18.73 U$1.14 | U$1.22 75.98,16.03 arc90 76.01,16 78.11,16 78.11,17.5 76.98,17.5 U$1.24 | U$1.36 79.29,25.82 | U$1.33 77.86,23.1 | 77.11,23.1 v75.81,23.1 | TP14.TP 79.21,16.2 | U$1.7 arc-90 70,21.6 71.71,21.6 71.71,20.08
  Top 0.305: 77.91,23.1 77.86,23.1 77.11,23.1 | 78.48,24.6 U$1.36
  Top 0.406: C39.2 26.21,15.55 v26.61,13.8 26.51,13.6 26.61,13.6 26.96,13.95 | C35.1 29.06,12.65 29.01,12.7 | T1.E 76.71,8.6 v73.01,8.6 | v85.91,21.1 arc-90 85.61,20.8 SJ5.1 | TP6.TP arc-90 67.71,28 C14.2
  Bottom 0.406: v73.01,8.6 C66.- | C16.2 v85.91,21.1
  Bottom 0.61: C34.2 23.61,25.09 U$6.1 | USB1.1 19.82,7.4
  other vias: 61.11,44 61.31,35.8 67.01,15.2 80.01,3.5 59.61,32.2 82.31,7.5 5.71,28.7 39.81,16.4 57.51,35.7 70.01,7.6 78.11,36.3 90.61,9.1 8.81,42.1 72.01,19.9 65.81,7.1 58.11,32.4 62.31,30.1 1.41,41.8 15.71,43.2 14.81,14.9 34.91,35.7 17.81,23.7 23.51,19.8 44.31,29.6 2.31,22.4 36.51,22.1 75.81,39.5 44.61,41.7 73.21,35.3 1.41,29.2 34.71,40.6 41.01,30.4 9.81,14.9 14.81,11.8 11.91,27.6 16.01,40.3 39.11,18.3 63.11,3.7 69.61,36.7 94.11,27.5 56.41,3 58.71,13.6 46.51,37.9 27.01,44.5 8.91,35.2 38.61,9.9 10.91,9.9 44.81,4.4 63.21,18.8 76.61,4.9 79.71,25.2 19.01,17.8 38.01,41.1 30.21,30.7 62.01,21.6 85.41,13.7 49.31,16.4 76.61,41.1 16.31,28.1 78.11,34.9 22.61,25.3 20.01,29.2 40.61,25.7 85.41,18.4 59.51,28.6 36.41,26.6 59.11,30.9 50.71,11.9 67.41,18.2 66.61,3.8 8.31,45.8 42.11,2.9 79.31,26.3 88.91,6.1 66.51,23.2 76.11,30.9 93.71,16.6 65.01,27.4 75.31,19.9
  pour Top: -1.89,-0.1 -0.73,48.96 arc-89 1.35,52.09 95.71,52.61 arc-90 100.27,46.19 99.81,0.5 68.91,0.6
  pour Bottom: -0.79,0.2 -1.29,52.3 99.41,52.4 99.6,3.73 arc-90 95.98,0.1
GPIO/CTCSS  (via drill 0.6)
  Top 0.305: SOUND.4 94.51,23.26 JP1.4
  Top 0.61: D2.C 85.71,31.4 | 85.71,32 85.71,31.4 | 85.71,31.4 v87.71,31.4
  Bottom 0.305: SOUND.4 95.21,23.26 JP1.4
  Bottom 0.406: 89.74,23.17 89.41,23.21 arc-45 88.11,24.91 88.11,30.12 arc30 87.83,31.21 87.83,31.29 v87.71,31.4
  Bottom 0.813: SOUND.4 89.74,23.17
JUMPER_SELECTED_VCC  (via drill 0.6)
  Top 0.406: v42.61,30 43.09,30.23 arc-42 48.36,32 55.16,32 arc-42 56.89,31.29 57.63,30.62 arc-48 58.11,28.83 58.11,22.69 arc-90 TTL_SERIAL.4
  Top 0.61: TTL_SERIAL.4 55.95,18.65 C47.2 arc90 55.96,17.7 C54.1 51.96,15.67 arc-39 51.04,15.3 v50.51,15.3 | v42.61,30 42.01,29.4 | 42.01,29.4 41.97,29.35 IC2.16 | IC2.16 40.44,26.77 C53.2 40.11,26.9 40.01,26.9 | IC2.16 42.01,29.52 42.01,29.4
  Bottom 0.61: C36.1 U$6.16 arc-90 U$6.16 | VCC_SEL.2 22.01,34.26 arc-90 21.15,33.4 19.49,33.4 arc48 19.09,33.27 arc42 18.11,31.48 18.11,26.77 arc39 18.65,25.27 20.56,22.9 21.11,22.2 21.56,21.75 C34.1 arc90 25.76,21.2 U$6.16 | C60.2 v42.61,30 | U$6.16 26.17,16.9 arc45 26.64,15.78 27.62,14.8 arc-45 28.31,13.12 28.31,13.1 arc90 30.02,11.4 43.52,11.4 arc36 46.58,12.41 v50.51,15.3
N$1  (via drill 0.6)
  Top 0.406: IC2.11 48.31,27.87 arc-90 49.04,28.6 v52.31,28.6
  Bottom 0.406: U$6.2 27.44,25.64 arc90 29.71,23.66 52.11,23.61 | 52.11,23.61 53.61,23.61 55.64,23.61 TTL_SERIAL.3 | 52.31,23.81 52.11,23.61
  Bottom 0.61: v52.31,28.6 52.31,27.9 52.31,23.81
N$2
  Top 0.61: R2.2 74.99,11.35 T1.B
N$3
  Top 0.254: U$1.8 68.98,21.08 arc-90 Q1.1
  Top 0.61: 60.49,23.2 C2.1 | C2.1 61.17,23.26 arc90 Q1.1 | R5.1 C2.1
N$4
  Top 0.254: U$1.9 arc90 65.63,16.23 Q1.2
  Top 0.61: 65.63,16.23 arc-90 64.7,16.7 C1.1 arc90 60.21,17.26 R5.2
N$5  (1 unrouted)
  Bottom 0.305: IC1.3 74.08,26.77
  Bottom 0.406: 83.96,30.15 arc90 84.01,29.7 80.3,29.69 | 83.71,30 arc90 C26.- | C67.1 79.66,42.11 arc-73 78.84,40.63 78.05,40.45 arc44 76.91,39.23 76.92,39.23 76.92,34.8 | 80.3,29.69 arc-67 79.5,29.84 79.5,30.14 79.5,31.01 arc90 78.61,31.9 78.11,31.9 arc-90 76.91,33.1 76.91,34.79 arc-90 76.92,34.8 | TP4.TP 79.71,29.7 | IC1.3 74.46,26.77 arc-90 74.01,27.22 74.01,34.09 arc-90 74.72,34.8 76.92,34.8 | 80.4,29.69 80.3,29.69
  Bottom 0.61: C67.1 80.41,43.45 R8.2
  Bottom 0.813: 84.01,29.7 83.71,30
N$6
  Bottom 0.406: IC1.7 69.52,28.04 arc90 67.61,26.73 67.61,21.7 arc90 TP2.TP
  Bottom 0.61: C65.+ 69.15,18.2 | 69.15,18.2 69.15,12.96 arc-90 R17.2 | 69.15,18.2 69.15,20.16 arc90 TP2.TP
N$7
  Top 0.305: JP1.5 94.24,20.51 SOUND.5
  Bottom 0.406: R3.1 81.69,19.6 88.33,19.6 arc90 SOUND.5
N$8
  Top 0.406: C46.2 48.63,19 arc-46 48.32,19.73 IC2.6
N$9
  Top 0.305: 26.13,29.9 arc-90 27.41,28.32 27.41,27.3 IC4.13
  Top 0.406: 26.13,29.9 R22.2
N$10  (via drill 0.6)
  Top 0.254: v77.21,20.1 78.46,20.1 arc-90 U$1.27 80.03,20.08 arc-90 TP1.TP
  Bottom 0.406: v77.21,20.1 arc90 76.31,19.3 C65.-
N$11  (via drill 0.6)
  Top 0.254: v80.11,22.6 79.6,21.76 arc-34 79.01,21.58 U$1.30
  Bottom 0.61: v80.11,22.6 80.8,23.42 arc-46 81.6,23.83 C26.+
N$12
  Top 0.254: U$1.13 71.48,16.85 arc-57 71.26,16.43 arc57 70.71,15.44 70.71,10.5
  Top 0.406: 62.14,6.1 arc55 63.07,6.16 64.63,7.89 arc-56 67.1,9.2 70.06,9.2 arc64 71.18,10.41 | R12.1 62.24,7 TP13.TP | 70.71,10.5 71.2,10.5 R2.1
  Top 0.61: R12.1 62.14,6.1 | 71.18,10.41 R2.1
N$13
  Top 0.305: USB_PINS.3 5.61,30.93 4.77,29.61 arc33 4.31,28.06 4.31,23.65 arc90 4.76,23.2 USB.2 | 17.63,21.4 17.67,21.36 IC4.25
  Top 0.406: USB.2 13.84,23.2 arc-39 15.21,22.71 16.14,21.99 arc39 17.63,21.4
N$14
  Top 0.254: U$1.39 76.01,26.08 76.01,26.7 arc-90 76.51,27.2 76.78,27.2
  Top 0.305: 79.91,34 79.46,34 arc89 78.6,33.35 78.62,29.8 arc-44 77.58,27.25 arc-90 77.53,27.2 76.78,27.2
  Top 0.406: 83.01,34.5 arc-90 82.51,34 79.91,34 C25.1 | C22.1 83.01,34.5 | 83.01,34.5 83.53,34.5 arc61 84.4,35.01 arc-58 85.06,35.42 D2.A
N$15
  Bottom 0.305: IC1.1 76.31,29.3 | 83.02,26.9 84.91,26.9 arc90 86.11,28.2 86.11,30.39 arc90 84.71,31.8 81.94,31.8 arc-63 81.61,32 C11.1
  Bottom 0.406: 75.11,29.4 75.11,32.3 R15.2 | 76.31,29.3 arc-45 77.51,28.8 77.89,28.43 arc45 81.58,26.9 83.02,26.9
  Bottom 0.61: C11.1 79.91,37.5 | 75.11,29.4 IC1.1
  Bottom 0.813: 79.91,37.5 C62.+
N$16
  Top 0.254: U$1.41 74.98,31.24 arc28 74.82,31.92 R7.2
N$17
  Top 0.254: R6.2 68.49,31.38 67.91,31.9 72.86,31.9 arc-90 74.48,30.08 U$1.42
N$18
  Top 0.254: U$1.48 71.48,28.1
  Top 0.305: C14.1 arc90 70.71,28.1 71.48,28.1
  Top 0.406: 71.48,28.1 D1.A
N$19  (via drill 0.6)
  Top 0.305: SOUND.2 96.41,28.74 JP1.2
  Top 0.406: 89.5,28.9 83.83,28.9 arc45 83.12,28.61 arc-45 82.87,28.5 v82.31,28.5
  Top 0.61: SOUND.2 89.5,28.9 | v77.61,30.7 77.71,29.8 arc-90 D1.C
  Bottom 0.406: v77.61,30.7 78.01,29.81 arc67 81.37,28.12 v82.31,28.5 | v82.31,28.5
  Bottom 0.61: 82.41,28.5 v82.31,28.5
N$20  (via drill 0.6)
  Top 0.254: U$1.26 78.99,19.58 arc-45 79.8,19.31 80.51,17.41 arc45 81.39,16.9 v85.91,16.9
  Bottom 0.61: v85.91,16.9 88.71,17.6 C7.1
N$21
  Bottom 0.813: SJ2.1 5.59,43.3 arc38 4.59,45.45 H2.B3,0
N$22
  Top 0.254: R11.1 67.54,11.1 arc45 68.69,11.58 arc45 69.21,13.04 69.21,18.67 arc-90 69.62,19.08 U$1.12
N$23
  Bottom 0.61: 74.44,37.6 R10.2 74.54,44.72 arc-90 75.9,46.09 arc90 C18.1 76.61,46.5 77.76,47.34 arc-45 80.12,48.32 R8.1 | 80.39,48.3 arc90 R8.1 | R8.1 80.67,48.58 arc-45 82.7,49.42 R9.1
  Bottom 0.813: R1.2 74.44,37.6
N$24
  Bottom 0.61: SJ3.1 94.98,46.14 arc-90 H1.B3,0
N$25
  Bottom 0.61: SJ4.1 H4.B3,0
N$26
  Top 0.406: C61.2 38.91,23.05 39.81,23.2 43.24,23.2 IC2.2
N$28
  Top 0.406: 47.21,9.93 arc90 AUDLED.A
  Top 0.61: STATUS_LEDS.3 49.14,6.67 arc90 47.21,8.6 47.21,9.93 | R11.2 57.37,12.77 arc28 55.13,13.2 49.01,13.2 arc57 47.47,12.46 arc33 47.14,11.38 AUDLED.A
N$29
  Top 0.254: U$1.28 82.87,20.58 arc-90 SJ5.2
N$30
  Top 0.406: STATUS_LEDS.1 55.62,6.1 | 55.62,6.1 R12.2 | 55.62,6.1 55.62,9.8
  Top 0.61: 55.62,9.8 PTTLED.A
N$31
  Top 0.254: U$1.15 72.48,16.43 72.5,14.69 arc89 73.81,13.4 JP3.2
N$32  (via drill 0.6)
  Top 0.406: IC2.12 47.11,26.71 | 47.11,24.6 47.01,24.6
  Top 0.61: 47.11,26.71 47.11,24.6 | TTL_SERIAL.2 55.38,25.77 54.15,24.77 arc-39 53.39,24.6 47.01,24.6 v39.01,24.6
  Bottom 0.406: 28.71,26.2 U$6.3
  Bottom 0.61: v39.01,24.6 29.52,24.6 arc-45 28.71,26.2
N$33
  Bottom 0.406: GOUT.2 81.21,7.2 arc90 79.71,8.7 76.85,8.7 arc-90 75.71,9.84 75.71,13.85 arc31 75.43,14.4 74.28,16.57 arc-31 74.01,17.5 74.01,19.2 arc-88 76.9,22.2 76.91,22.2 TP11.TP 77.79,26.93 arc93 76.34,28.05 IC1.2
N$34
  Bottom 0.406: IC1.6 71.89,26.73 arc-88 72.31,26.18 72.31,25.42 arc-90 71.69,24.5 71.66,24.5 arc50 70.93,24.16 R4.1
N$35
  Top 0.61: R23.1 63.41,37.75 PWR.A
N$36
  Top 0.305: 33.01,20.2 32.61,20.2 32.59,19.81 | 32.59,19.81 Q2.2 32.41,23.3 | 32.19,20.38 32.59,19.81 | IC4.6 26.36,22.7 27.48,22.7 arc41 28.77,23.18 arc-41 29.1,23.3 32.41,23.3 | 32.51,23.3 32.41,23.3
  Top 0.61: C28.2 33.01,20.2
N$37
  Top 0.305: 23.61,23.4 23.61,30.2
  Top 0.406: 31.71,31.6 Q2.1 28.84,31.9 C27.2 24.27,31.7 arc90 23.61,30.75 23.61,30.2 | IC4.7 25.89,23.3 23.61,23.4
N$38
  Top 0.61: F1.2 15.11,30.84 13.32,30.84 arc-90 12.61,31.85 12.61,32.99 arc36 12.37,33.73 D3.A
N$39
  Bottom 0.61: R21.1 72.94,33.46 R15.1
N$40
  Bottom 0.61: GOUT.1 arc90 85.41,7.56 R16.1
N$41
  Bottom 0.61: GIN.1 72.25,7.28 R17.1
N$42  (via drill 0.6)
  Top 0.406: C31.2 28.91,25.5 27.54,25.3 IC4.10 24.81,25.32 v24.61,24.5 | IC4.5 24.61,22.02 | 24.61,22.02 24.63,21.12 24.63,19.4 24.71,19.4 IC4.1 | L3.2 23.11,17.05 arc-90 IC4.1 | C39.1 26.25,17.1 | 26.25,17.1 26.34,18.38 IC4.1 | C29.1 26.71,17.13 26.25,17.1 | 24.61,22.02 24.71,22 v24.31,22.4 | C30.2 23.11,13.15
  Top 0.61: 23.11,13.15 L3.2
  Bottom 0.61: v24.61,24.5 v24.31,22.4
N$43
  Bottom 0.406: 70.81,5.85 arc90 72.56,4.1 73.9,4.1 arc90 75.01,5.51 75.01,13.08 arc28 74.81,13.87 73.58,16.16 arc-28 73.31,17.19 73.31,22.6 R4.2
  Bottom 0.61: GIN.2 70.81,5.85
N$44
  Bottom 0.61: R18.2 64.11,9.58 64.11,7.23 arc90 65.15,5.9 GIN.3
N$45
  Top 0.406: IC4.2 27.27,20.01 arc-57 28.1,19.54 30.51,14.1 31.81,10.9 USB-P1.D-
  Top 0.61: USB2.2 32.11,7.07 USB-P1.D-
N$46
  Bottom 0.406: U$6.8 35.06,27.68 | 36.38,29.3 C32.2
  Bottom 0.61: Q3.1 39.24,32.87 C32.2 | 35.06,27.68 arc-90 36.38,29.3
N$47
  Bottom 0.61: U$6.7 33.79,27.58 arc32 33.25,29.46 Q3.2 30.29,34.33 C33.2
N$48
  Bottom 0.406: C37.1 26.11,29.8 29.41,28.87 arc-75 30,28.08 U$6.4
N$49
  Top 0.406: IC4.3 27.29,20.7 arc-58 28.85,19.83 32.71,11.2 USB-P1.D+
  Top 0.61: USB2.3 34.12,7.27 USB-P1.D+
N$50
  Bottom 0.61: SJ1.1 3.42,7.18 arc54 H3.B3,0
N$51  (via drill 0.6)
  Top 0.305: IC4.12 26.3,26.6 24.51,26.6 v24.51,27.3
  Bottom 0.254: U$6.5 31.21,27.33
  Bottom 0.406: 31.21,27.33 31.16,28.41 arc67 30.37,29.47 27.67,30.39 arc25 27.17,31.8 20.13,31.8 arc90 19.01,30.58 19.01,28.29 arc90 20,27.3 v24.51,27.3
N$52  (via drill 0.6)
  Top 0.254: IC4.11 26.44,26 27.11,26 27.77,26.88 arc-60 28.61,27.2 29.94,27.2 arc39 30.96,27.56 v32.01,28.4
  Bottom 0.254: v32.01,28.4 32.41,28.4 32.52,28.2 U$6.6
N$53
  Bottom 0.61: CTS.1 35.98,20.4 arc-90 35.06,21.32 U$6.9
N$54
  Bottom 0.406: DSR.1 33.79,18.8
  Bottom 0.61: 33.79,18.8 U$6.10
N$55
  Bottom 0.61: RI.1 33.62,17 arc-90 32.52,18.1 U$6.11
N$56
  Bottom 0.61: DCD.1 32.98,15.1 arc-90 31.25,16.83 U$6.12
N$57
  Bottom 0.406: 29.91,21.61 U$6.13
  Bottom 0.61: 29.91,21.61 DTR.1 29.91,13.25 R20.2
N$58
  Bottom 0.61: RTS.1 28.31,19.2 U$6.14
N$59
  Top 0.406: USB-P2.D+ 17.32,16.27 arc-45 17.98,18.86 arc-45 18.94,19.4 19.71,19.4 IC4.28
  Top 0.61: USB1.2 17.32,7.37 USB-P2.D+
N$60
  Top 0.305: 17.88,19.96 arc-90 18.05,20.04 IC4.27
  Top 0.406: USB-P2.D- 16.16,10.56 arc45 16.51,11.87 16.51,16.9 16.51,17.28 arc-45 17.08,19.07 17.88,19.96
  Top 0.61: USB1.3 15.31,7.17 USB-P2.D-
N$61
  Top 0.406: IC2.9 50.94,27.07 arc-90 TP18.TP
N$62
  Top 0.813: PWR_HEADER.1 33.77,41.5 30.61,41.5 | C40.+ 30.61,41.5 | 30.61,41.5 30.03,42.2 C20.2 26.06,43.35 IC3.2 IC3.4 17.91,37.49 arc90 19.4,36 VCC_SEL.1
N$63
  Top 0.305: USB_PINS.1 3.36,30.28 arc-32 3.81,28.71 3.81,22.85 arc90 4.26,22.4 USB.3 | 19.08,20.7 19.09,20.7 IC4.26 17.62,20.7
  Top 0.406: USB.3 13.74,22.4 arc-39 14.94,21.97 16.05,21.08 arc39 17.62,20.7
N$64
  Top 0.254: U$1.6 69.66,22.08 arc-85 68.22,23.4 TP19.TP
N$65  (via drill 0.6)
  Top 0.305: IC4.17 18.76,26.64 arc90 v17.11,25
  Bottom 0.61: v17.11,25 16.86,25 arc-50 15.86,25.46 J_PSELF.1
N$66
  Top 0.305: 18.44,22.02 IC4.24
  Top 0.406: IC4.16 18.27,27.3 arc49 16.91,26.69 15.51,25.1 | 15.51,25.1 15.06,24.7 15.21,24.55 TP17.TP | 18.44,22.02 arc-59 16.77,22.97 15.51,25.1 | IC4.24 20.5,22.02 arc-90 21.21,21.3 21.21,17.5 arc-90 L3.1 19.36,15.15
  Top 0.61: 15.06,24.7 C42.1 | C41.1 19.36,15.15
N$67
  Top 0.254: TP20.TP 74.01,17.55 U$1.18
N$68
  Top 0.305: IC4.4 26.39,21.4
  Top 0.406: IC4.4 27.58,21.38 arc-60 29.44,20.33 29.81,19.7 32.08,14.91 arc66 33.2,14.22 R19.2
N$69  (via drill 0.6)
  Top 0.406: IC2.13 45.81,26.81 45.81,27.8 45.85,28.02 arc-61 48.92,29.8 v50.91,29.8
  Bottom 0.406: v50.91,29.8 50.91,30.2 | RS232_SERIAL.2 50.94,39.63 arc-90 52.71,41.4 54.43,41.4 arc90 X2.2
  Bottom 0.61: 50.91,30.2 50.94,32.17 RS232_SERIAL.2
N$70  (via drill 0.6)
  Top 0.406: IC2.14 44.51,27.49 44.64,27.9 arc-46 47.73,30.68 arc-18 48.51,30.8 v53.41,30.8
  Top 0.61: RS232_SERIAL.3 53.41,42.23 53.21,42.73 X2.3
  Bottom 0.406: 53.41,39.33 RS232_SERIAL.3
  Bottom 0.61: v53.41,30.8 53.41,39.33
N$71
  Top 0.813: D4.A 72.11,42.8 72.01,43.2 JP2.1
N$72
  Top 0.406: C49.1 47.05,17.98 IC2.5
N$73
  Top 0.406: C49.2 45.41,18.05 45.71,19.5 45.78,20.37 IC2.4
N$74
  Top 0.406: C48.1 42.91,18 44.36,19.35 arc47 44.51,19.72 44.51,20.53 IC2.3
N$75
  Top 0.406: C48.2 41.11,18 41.87,19.16 arc35 42.01,19.63 IC2.1
N$76
  Top 0.254: U$1.43 73.98,29.53 arc45 73.22,30.1 TP21.TP
N$77
  Top 0.305: U$1.11 69.21,19.58 arc69 68.51,19.1 68.51,14.06 arc-30 68.33,13.39 TP22.TP
N$78
  Top 0.406: R13.1 43.61,3.19 arc90 44.3,2.5 50.41,2.5 50.83,2.51 arc89 51.68,3.38 STATUS_LEDS.2
  Top 0.61: STATUS_LEDS.2 PWRLED.A
N$79
  Bottom 0.61: J_PSELF.2 13.55,27.66 arc45 13.12,28.69 arc-45 12.21,30.89 12.21,34.15 R24.2
N$80
  Top 0.406: IC2.8 51.09,20.2 TP25.TP
N$81
  Top 0.406: USB.1 9.79,24 arc90 10.71,24.92 10.71,28.44 arc45 10.39,29.23 10.37,29.24 F1.1
N$82  (via drill 0.6)
  Top 0.305: v62.81,24.4 62.81,27.36 arc-90 63.86,28.4 65.15,28.4 arc-75 66.32,27.66 66.87,26.51 arc64 67.68,26 68.11,26 v68.61,25.7
  Bottom 0.305: 69.42,25.49 IC1.5
  Bottom 0.406: v68.61,25.7 69.42,25.49
  Bottom 0.61: R1.1 68.21,38 | 68.21,38 66.91,37.9 arc90 63.11,33.7 C63.- 61.82,31.62 arc48 60.91,29.58 60.91,25.74 arc90 62.26,24.4 v62.81,24.4 | C10.1 68.41,37.6 68.21,38
N$83
  Bottom 0.61: R18.1 61.49,13.32 | 61.49,13.32 C64.+ | C58.1 61.41,13.34 61.49,13.32
N$84
  Bottom 0.61: R16.2 79.09,10.62
  Bottom 0.813: 79.09,10.62 C66.+
N$85
  Top 0.254: U$1.1 arc90 70.01,24.61 TP5.TP
N$86
  Bottom 0.406: GOUT.3 78.67,5.06 arc-90 76.41,2.6 71.21,2.6 arc-90 69.51,4.5 69.51,5.9 arc90 67.31,8.1 67.11,8.1 arc-90 65.91,9 65.91,19.8 arc90 65.31,20.8 arc-90 64.51,21.6 64.51,24.8 arc-90 65.61,26 65.74,26.13 arc45 66.21,27.27 arc-45 66.68,28.38 R21.2
PTT
  Top 0.305: SOUND.3 96.01,26 JP1.3
  Top 0.406: C13.1 87.21,13.9 87.21,24.64 arc-90 88.78,26 SOUND.3 | T1.C 83.21,10.4 | 83.21,10.4 85.16,10.4 arc33 86.18,10.7 | TP12.TP 83.21,10.4
  Top 0.61: 86.18,10.7 C13.1
VCC  (via drill 0.6)
  Top 0.254: v74.61,24.1 78.59,24.08 U$1.35 U$1.34 79.5,23.58 79.1,23.6 79.44,23.6 arc-27 81.35,23.83 C8.1 arc-90 79.49,21.08 U$1.29
  Top 0.406: IC4.23 20.89,22.68 arc45 21.01,22.97 21.01,29.95 R22.1 | 38.11,13.1 C57.+ 37.51,13.8 | TP16.TP 37.81,27.2 | 41.91,5.04 42.31,6.94 arc-37 43.03,8.59 43.5,8.9 | 19.81,32.06 20.32,31.66 21.67,31.66 22.11,31.7 arc45 24.51,34.1 24.51,35.26 24.55,35.3
  Top 0.61: v25.31,13.9 25.31,13.13 arc45 25.76,12.05 arc45 26.37,11.8 C35.2 27.97,10.08 arc71 28.64,9.61 USB-P1.VBUS 29.4,9.62 USB2.1 | 12.82,12.34 USB-P2.VBUS 12.82,7.22 USB1.4 12.61,6.29 arc90 14.71,3.8 40.17,3.8 arc90 41.91,5.04 | 12.82,12.34 C38.2 | 12.82,12.34 12.82,13.88 C55.+ | v42.01,31.7 41.26,31.6 41.11,31.6 arc90 37.91,27.9 TP16.TP | RS232_SERIAL.4 55.96,37.22 arc-69 55.05,36.25 54.82,36.24 arc-19 54,36.2 46.67,36.2 arc-73 44.82,37.37 44.63,38.01 arc71 43.23,39.09 v43.01,39.2 C52.1 C51.1 35.05,39.25 arc84 33.84,38.17 33.84,38.01 arc-84 31.7,36.09 24.91,36.1 24.61,35.9 VCC_SEL.3 24.55,35.3 24.55,34.76 | R13.2 43.8,9.18 | 43.8,9.18 43.91,9.71 arc90 42.82,11 40.73,11 arc-59 39.9,11.23 38.11,13.1 | 37.71,14.8 46.97,14.8 arc87 47.89,15.67 v47.91,16.2 | 37.71,14.8 37.51,13.8 | 37.81,27.2 37.71,14.8 | 21.01,29.95 C44.2 20.32,31.66 | 62.41,39.35 R23.2 | 43.5,8.9 43.8,9.18 | 71.96,38 arc90 D4.C | v69.21,40.7 arc90 68.88,40.37 68.88,38.73
  Top 0.813: C50.1 27.16,48.4 L1.2 23.81,48.1 | IC3.3 23.81,48.1 | RS232_SERIAL.4 59.76,39.36 C19.1 62.41,39.35 | 32.84,45.3 PWR_HEADER.2 | PWR_HEADER.2 35.06,45.2 arc-90 36.31,43.95 36.31,39.25 C51.1 | 71.91,38.05 D4.C 71.35,37.95 arc-45 68.88,38.73 68.92,38.71 arc40 67.05,39.4 62.56,39.4 R23.2 | 23.81,48.1 27.64,48.1 arc-46 29.52,47.47 31.03,45.9 arc46 32.45,45.3 PWR_HEADER.2 | 71.96,38 76.84,38 arc32 80.29,38.99 81.26,39.59 arc-32 83.75,40.3 v86.61,40.3
  Bottom 0.305: v74.61,24.1 74.51,24.1
  Bottom 0.406: 74.51,24.1 73.8,24.38 arc-67 73.1,25.38 73.05,27.6 arc89 71.31,29.3 | 69.21,39.7 71.75,39.7 arc-90 72.61,38.84 72.61,36.3 72.35,36.2 | 71.31,29.3 71.31,34.67 arc-90 72.35,36.2 | 72.35,36.2 TP7.TP | IC1.8 71.31,29.3
  Bottom 0.61: C56.+ v47.91,16.2 | USB-P2.VBUS 12.82,11.75 arc-90 14.37,13.3 20.06,13.3 C43.2 20.81,12.25 21.17,11.53 arc63 23.5,10.2 29.6,10.22 USB-P1.VBUS | v42.01,31.7 42.16,31.57 arc80 44.21,33.36 44.21,37.7 arc53 43.31,39.1 v43.01,39.2 | R24.1 16.61,34.2 arc90 17.31,34.9 17.31,38.41 arc-90 18.7,39.8 23.3,39.8 arc-90 24.55,38.55 VCC_SEL.3 | R9.2 84.21,44.15 86.66,44.1 C12.1 | C12.1 86.61,44.91 arc-90 87.51,45.8 | v86.61,40.3 C12.1 | C5.1 69.21,39.7 v69.21,40.7
  Bottom 0.813: C17.1 84.21,44.15 | 87.51,45.8 C6.1

### Text on the board
Top: TOP
Bottom: BOTTOM
tNames: PWR hdr. | USB | GND | GND | RS232 SERIAL | ext. / PSU | GND | +5V | multitool | +5V | 3V3 / reg. | +3.3V | +5V | PCB revision B / Lasse OH3HZB 2019 / (RNETdongle sch: OH7JEV) | RADIO / D9 | TTL level / selection | GND | RX | TX | PWR LED | 5V | 3V3 | 5V | 1 | GND | 1A | GL850G | TTL / RX | +5V | GND | MAX3232 | vsel | TTL / TX | CM108 | GND | VCC | USB / IN | GPIO4 | GND | mute | GND | audio | power | ptt | Gout | PTT | GND | AUD | PWR | Gin | USB2.0 p1 | USB2.0 p2 | AUDIO_D9: 1: A_TX(out) 2: SQ 3: PTT 4: GPIO 5: A_RX(in) 6,8,9: GND
bNames: USB multitool | RS232 SERIAL / PORT (D9M) | OH3HZB / 2019 | GND | TTL / serial | RX | TX | 1 | GND | PSELF / JUMPER | RX | 4 | TX | VCC | GL850G pin17 / 0: bus-powered / 1: self-powered | USB 2.0 / PORT 1 | USB 2.0 / PORT2